# Altium project SignControlSchematic_v0.PrjPcb
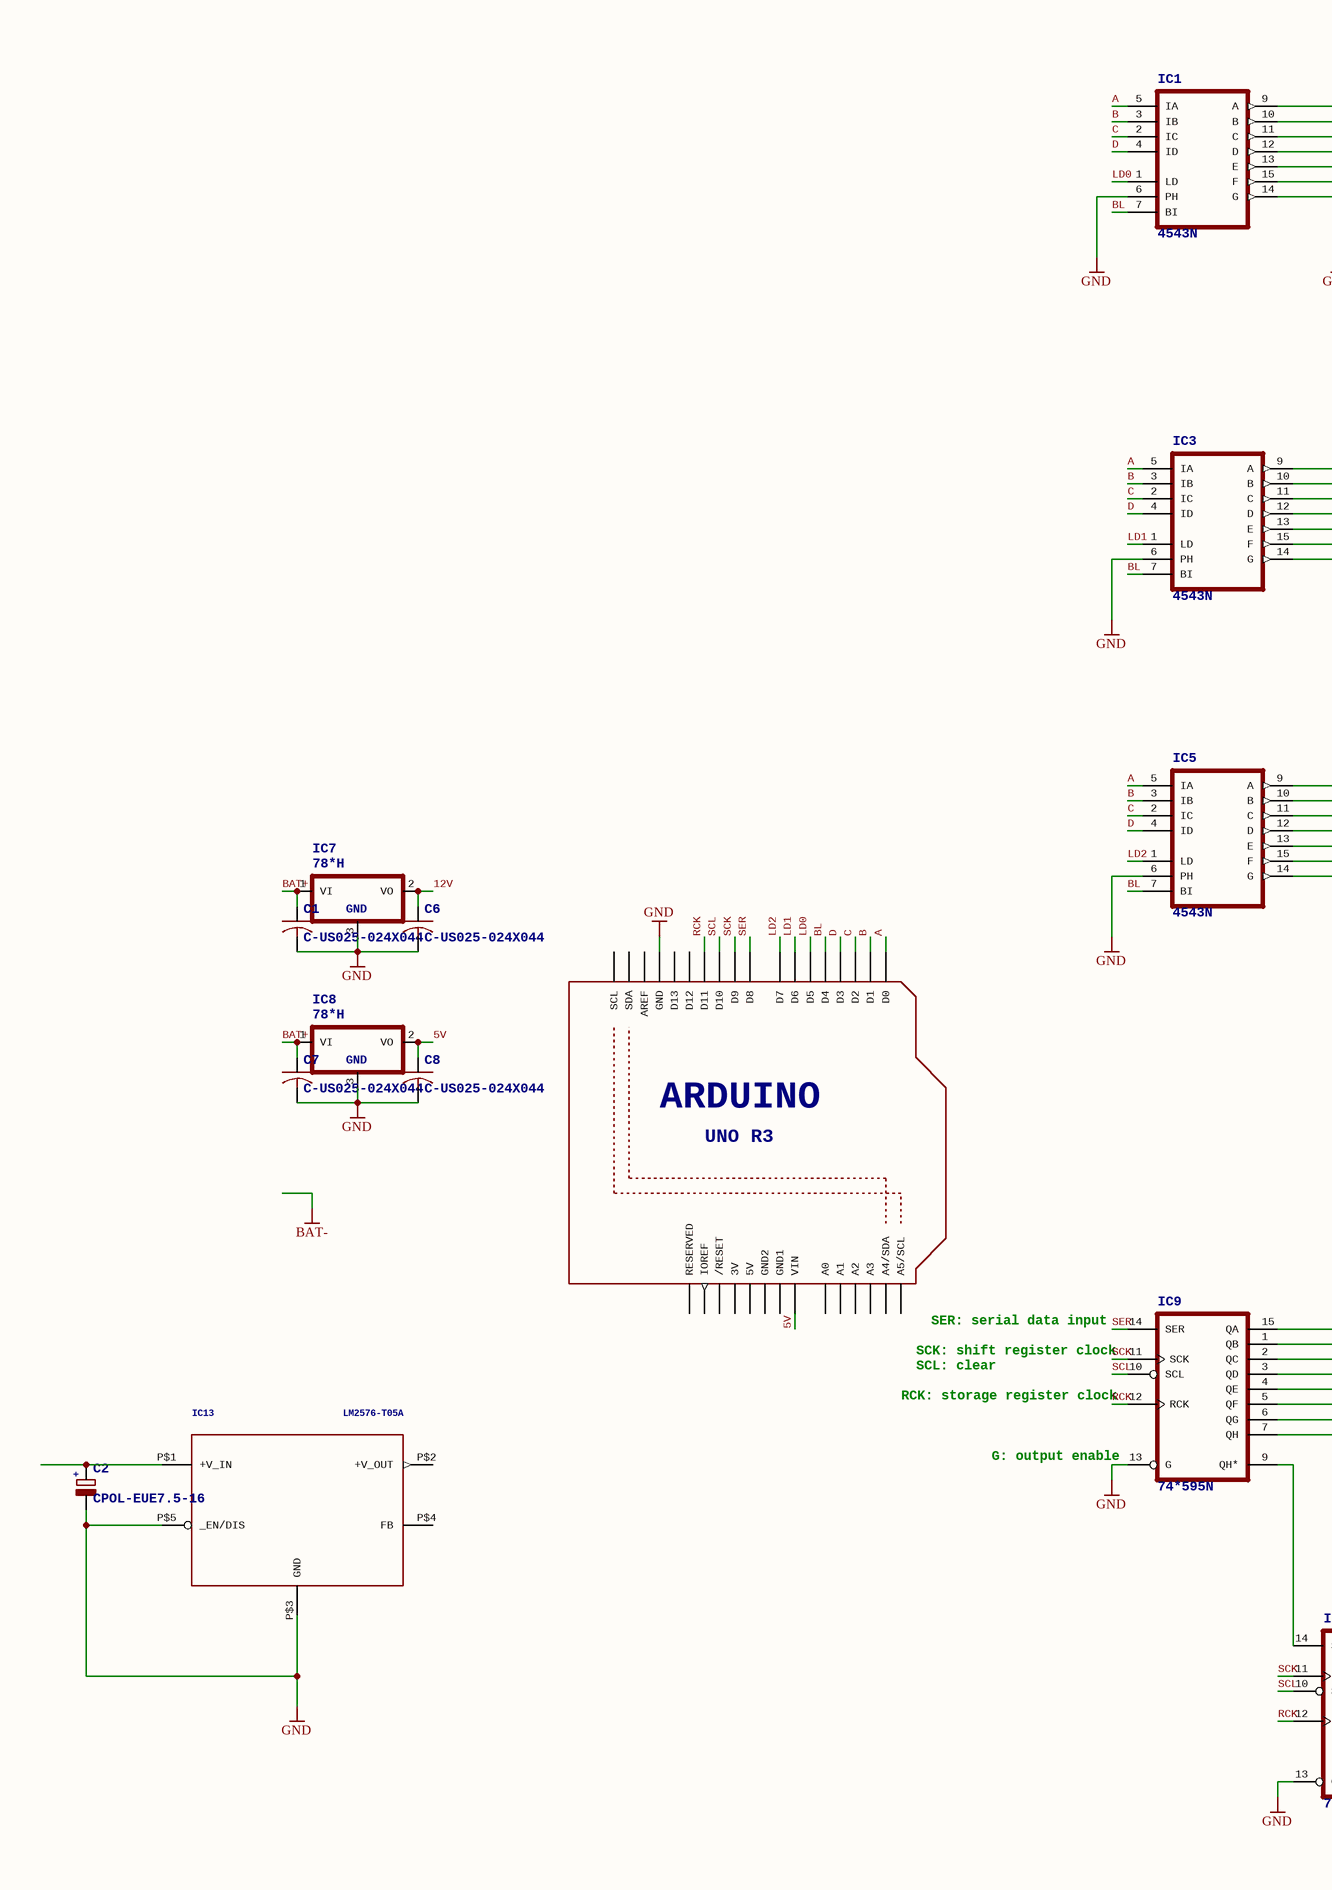
[diagram p0: SignControlSchematic_v0.SchDoc, left]
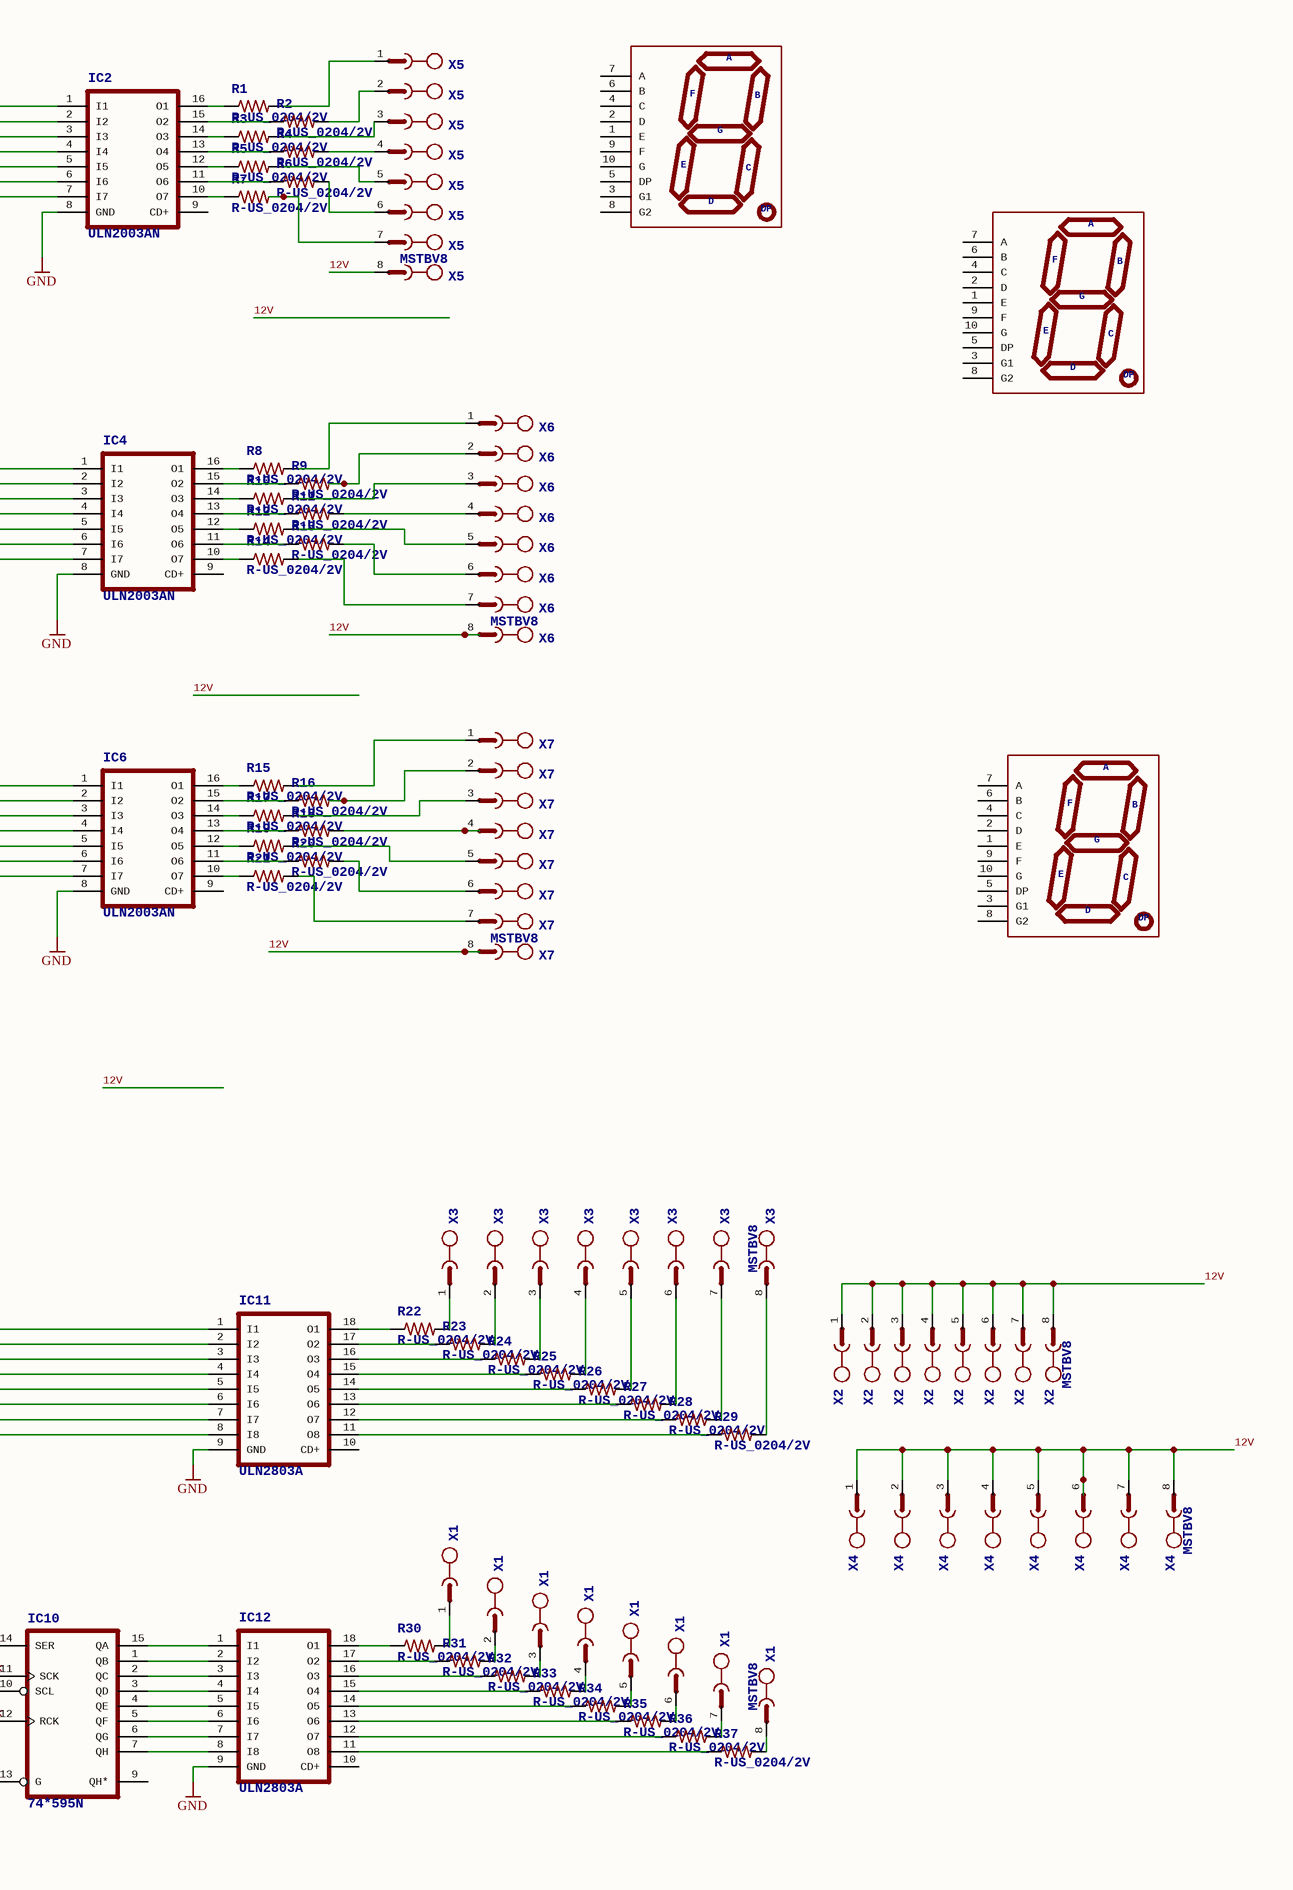
[diagram p1: SignControlSchematic_v0.SchDoc, right]
1 sheet, 66 parts. Net scope: global (net labels, ports and power ports of the same name join across sheets).
Board file: SignControlSchematic_v0.PcbDoc

## Sheet SignControlSchematic_v0.SchDoc
size 439 x 321 mm

### Parts
C1  >NAME: C1  [C025-024X044]  (hidden comment: C-US025-024X044)
C2  >NAME: C2  [E7,5-16]  (hidden comment: CPOL-EUE7.5-16)
C6  >NAME: C6  [C025-024X044]  (hidden comment: C-US025-024X044)
C7  >NAME: C7  [C025-024X044]  (hidden comment: C-US025-024X044)
C8  >NAME: C8  [C025-024X044]  (hidden comment: C-US025-024X044)
IC1  >NAME: IC1  [DIL16]  (hidden comment: 4543N)
IC2  >NAME: IC2  [DIL16]  (hidden comment: ULN2003AN)
IC3  >NAME: IC3  [DIL16]  (hidden comment: 4543N)
IC4  >NAME: IC4  [DIL16]  (hidden comment: ULN2003AN)
IC5  >NAME: IC5  [DIL16]  (hidden comment: 4543N)
IC6  >NAME: IC6  [DIL16]  (hidden comment: ULN2003AN)
IC7  >NAME: IC7  [TO39]  (hidden comment: 78*H)
IC8  >NAME: IC8  [TO39]  (hidden comment: 78*H)
IC9  >NAME: IC9  [DIL16]  (hidden comment: 74*595N)
IC10  >NAME: IC10  [DIL16]  (hidden comment: 74*595N)
IC11  >NAME: IC11  [DIL18]  (hidden comment: ULN2803A)
IC12  >NAME: IC12  [DIL18]  (hidden comment: ULN2803A)
IC13  >NAME: IC13  [TO-220-5_IN-LINE]  (hidden comment: LM2576-T05A)
R1  >NAME: R1  [0204V]  (hidden comment: R-US_0204/2V)
R2  >NAME: R2  [0204V]  (hidden comment: R-US_0204/2V)
R3  >NAME: R3  [0204V]  (hidden comment: R-US_0204/2V)
R4  >NAME: R4  [0204V]  (hidden comment: R-US_0204/2V)
R5  >NAME: R5  [0204V]  (hidden comment: R-US_0204/2V)
R6  >NAME: R6  [0204V]  (hidden comment: R-US_0204/2V)
R7  >NAME: R7  [0204V]  (hidden comment: R-US_0204/2V)
R8  >NAME: R8  [0204V]  (hidden comment: R-US_0204/2V)
R9  >NAME: R9  [0204V]  (hidden comment: R-US_0204/2V)
R10  >NAME: R10  [0204V]  (hidden comment: R-US_0204/2V)
R11  >NAME: R11  [0204V]  (hidden comment: R-US_0204/2V)
R12  >NAME: R12  [0204V]  (hidden comment: R-US_0204/2V)
R13  >NAME: R13  [0204V]  (hidden comment: R-US_0204/2V)
R14  >NAME: R14  [0204V]  (hidden comment: R-US_0204/2V)
R15  >NAME: R15  [0204V]  (hidden comment: R-US_0204/2V)
R16  >NAME: R16  [0204V]  (hidden comment: R-US_0204/2V)
R17  >NAME: R17  [0204V]  (hidden comment: R-US_0204/2V)
R18  >NAME: R18  [0204V]  (hidden comment: R-US_0204/2V)
R19  >NAME: R19  [0204V]  (hidden comment: R-US_0204/2V)
R20  >NAME: R20  [0204V]  (hidden comment: R-US_0204/2V)
R21  >NAME: R21  [0204V]  (hidden comment: R-US_0204/2V)
R22  >NAME: R22  [0204V]  (hidden comment: R-US_0204/2V)
R23  >NAME: R23  [0204V]  (hidden comment: R-US_0204/2V)
R24  >NAME: R24  [0204V]  (hidden comment: R-US_0204/2V)
R25  >NAME: R25  [0204V]  (hidden comment: R-US_0204/2V)
R26  >NAME: R26  [0204V]  (hidden comment: R-US_0204/2V)
R27  >NAME: R27  [0204V]  (hidden comment: R-US_0204/2V)
R28  >NAME: R28  [0204V]  (hidden comment: R-US_0204/2V)
R29  >NAME: R29  [0204V]  (hidden comment: R-US_0204/2V)
R30  >NAME: R30  [0204V]  (hidden comment: R-US_0204/2V)
R31  >NAME: R31  [0204V]  (hidden comment: R-US_0204/2V)
R32  >NAME: R32  [0204V]  (hidden comment: R-US_0204/2V)
R33  >NAME: R33  [0204V]  (hidden comment: R-US_0204/2V)
R34  >NAME: R34  [0204V]  (hidden comment: R-US_0204/2V)
R35  >NAME: R35  [0204V]  (hidden comment: R-US_0204/2V)
R36  >NAME: R36  [0204V]  (hidden comment: R-US_0204/2V)
R37  >NAME: R37  [0204V]  (hidden comment: R-US_0204/2V)
U1  ARDUINOR3-BPLACE  [ARDUINOR3-BPLACE]  (value not drawn)
U$1  7-SEGMENT-DISPLAY-1"-RED  [7-SEGMENT-1"PTH]  (value not drawn)
U$2  7-SEGMENT-DISPLAY-1"-RED  [7-SEGMENT-1"PTH]  (value not drawn)
U$3  7-SEGMENT-DISPLAY-1"-RED  [7-SEGMENT-1"PTH]  (value not drawn)
X1  >NAME: X1  [MSTBV8]  (hidden comment: MSTBV8)  (parts A,B,C,D,E,F,G,H of 8)
X2  >NAME: X2  [MSTBV8]  (hidden comment: MSTBV8)  (parts A,B,C,D,E,F,G,H of 8)
X3  >NAME: X3  [MSTBV8]  (hidden comment: MSTBV8)  (parts A,B,C,D,E,F,G,H of 8)
X4  >NAME: X4  [MSTBV8]  (hidden comment: MSTBV8)  (parts A,B,C,D,E,F,G,H of 8)
X5  >NAME: X5  [MSTBV8]  (hidden comment: MSTBV8)  (parts A,B,C,D,E,F,G,H of 8)
X6  >NAME: X6  [MSTBV8]  (hidden comment: MSTBV8)  (parts A,B,C,D,E,F,G,H of 8)
X7  >NAME: X7  [MSTBV8]  (hidden comment: MSTBV8)  (parts A,B,C,D,E,F,G,H of 8)

### Nets
GND: C1.2 C2.- C6.2 C7.2 C8.2 IC1.6(PH) IC2.8(GND) IC3.6(PH) IC4.8(GND) IC5.6(PH) IC6.8(GND) IC7.3(GND) IC8.3(GND) IC9.13(G) IC10.13(G) IC11.9(GND) IC12.9(GND) IC13.P$3(GND) IC13.P$5(_EN/DIS) U1.GND
5V: C8.1 IC8.2(VO) U1.VIN
12V: C6.1 IC7.2(VO) X2.1 X2.2 X2.3 X2.4 X2.5 X2.6 X2.7 X2.8 X4.1 X4.2 X4.3 X4.4 X4.5 X4.6 X4.7 X4.8 X5.8 X6.8 X7.8
A: IC1.5(IA) IC3.5(IA) IC5.5(IA) U1.D0
B: IC1.3(IB) IC3.3(IB) IC5.3(IB) U1.D1
BAT+: C1.1 C7.1 IC7.1(VI) IC8.1(VI)
BL: IC1.7(BI) IC3.7(BI) IC5.7(BI) U1.D4
C: IC1.2(IC) IC3.2(IC) IC5.2(IC) U1.D2
D: IC1.4(ID) IC3.4(ID) IC5.4(ID) U1.D3
LD0: IC1.1(LD) U1.D5
LD1: IC3.1(LD) U1.D6
LD2: IC5.1(LD) U1.D7
RCK: IC9.12(RCK) IC10.12(RCK) U1.D11
SCK: IC9.11(SCK) IC10.11(SCK) U1.D9
SCL: IC9.10(SCL) IC10.10(SCL) U1.D10
SER: IC9.14(SER) U1.D8
NetC2_+: C2.+ IC13.P$1(+V_IN)
NetIC1_9: IC1.9(A) IC2.1(I1)
NetIC1_10: IC1.10(B) IC2.2(I2)
NetIC1_11: IC1.11(C) IC2.3(I3)
NetIC1_12: IC1.12(D) IC2.4(I4)
NetIC1_13: IC1.13(E) IC2.5(I5)
NetIC1_14: IC1.14(G) IC2.7(I7)
NetIC1_15: IC1.15(F) IC2.6(I6)
NetIC2_10: IC2.10(O7) R7.1
NetIC2_11: IC2.11(O6) R6.1
NetIC2_12: IC2.12(O5) R5.1
NetIC2_13: IC2.13(O4) R4.1
NetIC2_14: IC2.14(O3) R3.1
NetIC2_15: IC2.15(O2) R2.1
NetIC2_16: IC2.16(O1) R1.1
NetIC3_9: IC3.9(A) IC4.1(I1)
NetIC3_10: IC3.10(B) IC4.2(I2)
NetIC3_11: IC3.11(C) IC4.3(I3)
NetIC3_12: IC3.12(D) IC4.4(I4)
NetIC3_13: IC3.13(E) IC4.5(I5)
NetIC3_14: IC3.14(G) IC4.7(I7)
NetIC3_15: IC3.15(F) IC4.6(I6)
NetIC4_10: IC4.10(O7) R14.1
NetIC4_11: IC4.11(O6) R13.1
NetIC4_12: IC4.12(O5) R12.1
NetIC4_13: IC4.13(O4) R11.1
NetIC4_14: IC4.14(O3) R10.1
NetIC4_15: IC4.15(O2) R9.1
NetIC4_16: IC4.16(O1) R8.1
NetIC5_9: IC5.9(A) IC6.1(I1)
NetIC5_10: IC5.10(B) IC6.2(I2)
NetIC5_11: IC5.11(C) IC6.3(I3)
NetIC5_12: IC5.12(D) IC6.4(I4)
NetIC5_13: IC5.13(E) IC6.5(I5)
NetIC5_14: IC5.14(G) IC6.7(I7)
NetIC5_15: IC5.15(F) IC6.6(I6)
NetIC6_10: IC6.10(O7) R21.1
NetIC6_11: IC6.11(O6) R20.1
NetIC6_12: IC6.12(O5) R19.1
NetIC6_13: IC6.13(O4) R18.1
NetIC6_14: IC6.14(O3) R17.1
NetIC6_15: IC6.15(O2) R16.1
NetIC6_16: IC6.16(O1) R15.1
NetIC9_1: IC9.1(QB) IC11.2(I2)
NetIC9_2: IC9.2(QC) IC11.3(I3)
NetIC9_3: IC9.3(QD) IC11.4(I4)
NetIC9_4: IC9.4(QE) IC11.5(I5)
NetIC9_5: IC9.5(QF) IC11.6(I6)
NetIC9_6: IC9.6(QG) IC11.7(I7)
NetIC9_7: IC9.7(QH) IC11.8(I8)
NetIC9_9: IC9.9(QH*) IC10.14(SER)
NetIC9_15: IC9.15(QA) IC11.1(I1)
NetIC10_1: IC10.1(QB) IC12.2(I2)
NetIC10_2: IC10.2(QC) IC12.3(I3)
NetIC10_3: IC10.3(QD) IC12.4(I4)
NetIC10_4: IC10.4(QE) IC12.5(I5)
NetIC10_5: IC10.5(QF) IC12.6(I6)
NetIC10_6: IC10.6(QG) IC12.7(I7)
NetIC10_7: IC10.7(QH) IC12.8(I8)
NetIC10_15: IC10.15(QA) IC12.1(I1)
NetIC11_11: IC11.11(O8) R29.1
NetIC11_12: IC11.12(O7) R28.1
NetIC11_13: IC11.13(O6) R27.1
NetIC11_14: IC11.14(O5) R26.1
NetIC11_15: IC11.15(O4) R25.1
NetIC11_16: IC11.16(O3) R24.1
NetIC11_17: IC11.17(O2) R23.1
NetIC11_18: IC11.18(O1) R22.1
NetIC12_11: IC12.11(O8) R37.1
NetIC12_12: IC12.12(O7) R36.1
NetIC12_13: IC12.13(O6) R35.1
NetIC12_14: IC12.14(O5) R34.1
NetIC12_15: IC12.15(O4) R33.1
NetIC12_16: IC12.16(O3) R32.1
NetIC12_17: IC12.17(O2) R31.1
NetIC12_18: IC12.18(O1) R30.1
NetR1_2: R1.2 X5.1
NetR2_2: R2.2 X5.2
NetR3_2: R3.2 X5.3
NetR4_2: R4.2 X5.4
NetR5_2: R5.2 X5.5
NetR6_2: R6.2 X5.6
NetR7_2: R7.2 X5.7
NetR8_2: R8.2 X6.1
NetR9_2: R9.2 X6.2
NetR10_2: R10.2 X6.3
NetR11_2: R11.2 X6.4
NetR12_2: R12.2 X6.5
NetR13_2: R13.2 X6.6
NetR14_2: R14.2 X6.7
NetR15_2: R15.2 X7.1
NetR16_2: R16.2 X7.2
NetR17_2: R17.2 X7.3
NetR18_2: R18.2 X7.4
NetR19_2: R19.2 X7.5
NetR20_2: R20.2 X7.6
NetR21_2: R21.2 X7.7
NetR22_2: R22.2 X3.1
NetR23_2: R23.2 X3.2
NetR24_2: R24.2 X3.3
NetR25_2: R25.2 X3.4
NetR26_2: R26.2 X3.5
NetR27_2: R27.2 X3.6
NetR28_2: R28.2 X3.7
NetR29_2: R29.2 X3.8
NetR30_2: R30.2 X1.1
NetR31_2: R31.2 X1.2
NetR32_2: R32.2 X1.3
NetR33_2: R33.2 X1.4
NetR34_2: R34.2 X1.5
NetR35_2: R35.2 X1.6
NetR36_2: R36.2 X1.7
NetR37_2: R37.2 X1.8

Not connected (* = marked no-connect by the designer): IC2 9(CD+); IC4 9(CD+); IC6 9(CD+); IC10 9(QH*); IC11 10(CD+); IC12 10(CD+); IC13 P$2(+V_OUT) P$4(FB); U1 3V 5V A0 A1 A2 A3 A4(A4/SDA) A5(A5/SCL) AREF D12 D13 GND1 GND2 IOREF RESERVED RESET(/RESET) SCL SDA; U$1 1(E) 2(D) 3(G1) 4(C) 5(DP) 6(B) 7(A) 8(G2) 9(F) 10(G); U$2 1(E) 2(D) 3(G1) 4(C) 5(DP) 6(B) 7(A) 8(G2) 9(F) 10(G); U$3 1(E) 2(D) 3(G1) 4(C) 5(DP) 6(B) 7(A) 8(G2) 9(F) 10(G)

### Notes on the sheet
- SCK: shift register clock
- SCL: clear
- (near U1) SER: serial data input
- RCK: storage register clock
- (near IC9) G: output enable

### Library data of the parts
C1 C6-C8 = C-US025-024X044: <B>CAPACITOR</B>, American symbol; >VALUE: C-US025-024X044
C2 = CPOL-EUE7.5-16: <B>POLARIZED CAPACITOR</B>, European symbol; +: +; >VALUE: CPOL-EUE7.5-16
IC1 IC3 IC5 = 4543N: BCD to 7-segment <b>LCD DECODER</b>; >VALUE: 4543N
IC2 IC4 IC6 = ULN2003AN: <b>DRIVER ARRAY</b>; >VALUE: ULN2003AN
IC7 IC8 = 78*H: Positive <b>VOLTAGE REGULATOR</b> / <p> / Added bigger pads to the TO-92 package; >VALUE: 78*H; GND: GND
IC9 IC10 = 74*595N: 8-bit <b>SHIFT REGISTER</b>, output latch; >VALUE: 74*595N
IC11 IC12 = ULN2803A: <b>DRIVER ARRAY</b>; >VALUE: ULN2803A
IC13 = LM2576-T05A: LM2576/LM2576HV Series / SIMPLE SWITCHER® 3A Step-Down Voltage Regulator / IN-LINE PACKAGE; >VALUE: LM2576-T05A
R1-R37 = R-US_0204/2V: <B>RESISTOR</B>, American symbol; >VALUE: R-US_0204/2V
U1 = ARDUINOR3-BPLACE: This is a new object for the new Arduino R3 - with extra pins that you may want to use (such as IOref, and duplicated A4/A5; ARDUINO: ARDUINO; UNO R3: UNO R3
U$1-U$3 = 7-SEGMENT-DISPLAY-1"-RED: 7-Segment Display 1" Red (COM-08546) / EZ is for kits. Pads are only exposed on the bottom side to help prevent soldering in upside down.; A: A; B: B; C: C; D: D; E: E; F: F; G: G; DP: DP
X1-X7 = MSTBV8: <b>PHOENIX</b>; MPN: MSTBV 2,5/8-GF-5.08; OC_FARNELL: 1792797; OC_NEWARK: 69R9850